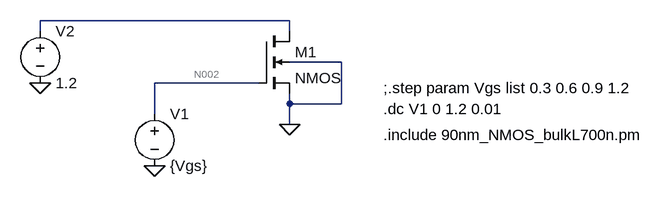
[diagram p0: schematic Circuito.asc]
Circuito.asc, the LTspice schematic file:
Version 4
SHEET 1 1136 680
WIRE 320 64 -64 64
WIRE -64 80 -64 64
WIRE 320 80 320 64
WIRE 400 128 320 128
WIRE 272 160 112 160
WIRE 320 192 320 176
WIRE 400 192 400 128
WIRE 400 192 320 192
WIRE 112 208 112 160
WIRE 320 224 320 192
FLAG -64 160 0
FLAG 112 288 0
FLAG 320 224 0
SYMBOL voltage 112 192 R0
SYMATTR InstName V1
SYMATTR Value {Vgs}
SYMBOL voltage -64 64 R0
SYMATTR InstName V2
SYMATTR Value 1.2
SYMBOL nmos4 272 80 R0
SYMATTR InstName M1
SYMATTR Value2 l=70n w=70n
TEXT 464 240 Left 2 !.include 90nm_NMOS_bulkL700n.pm
TEXT 464 200 Left 2 !.dc V1 0 1.2 0.01
TEXT 464 168 Left 2 !;.step param Vgs list 0.3 0.6 0.9 1.2

The netlist it stands for:
* Circuito.asc
V1 N002 0 {Vgs}
V2 N001 0 1.2
M1 N001 N002 0 0 NMOS l=70n w=70n
.model NMOS NMOS
.model PMOS PMOS
.lib standard.mos
.include 90nm_NMOS_bulkL700n.pm
.dc V1 0 1.2 0.01
;.step param Vgs list 0.3 0.6 0.9 1.2
.backanno
.end

* Results of the author's LTspice run, read from the files saved beside the schematic
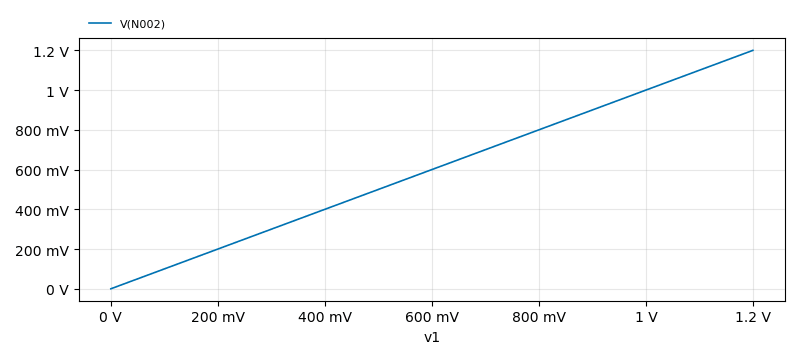
[diagram p1: DC transfer characteristic of Circuito.asc, plotted from the saved traces]
* DC transfer characteristic, 1 run:
*   V(N002): 0 V at v1=0 V, 1.2 V at v1=1.2 V, min 0 V, max 1.2 V